# EAGLE design rev001_safe002 (EAGLE 5.08)
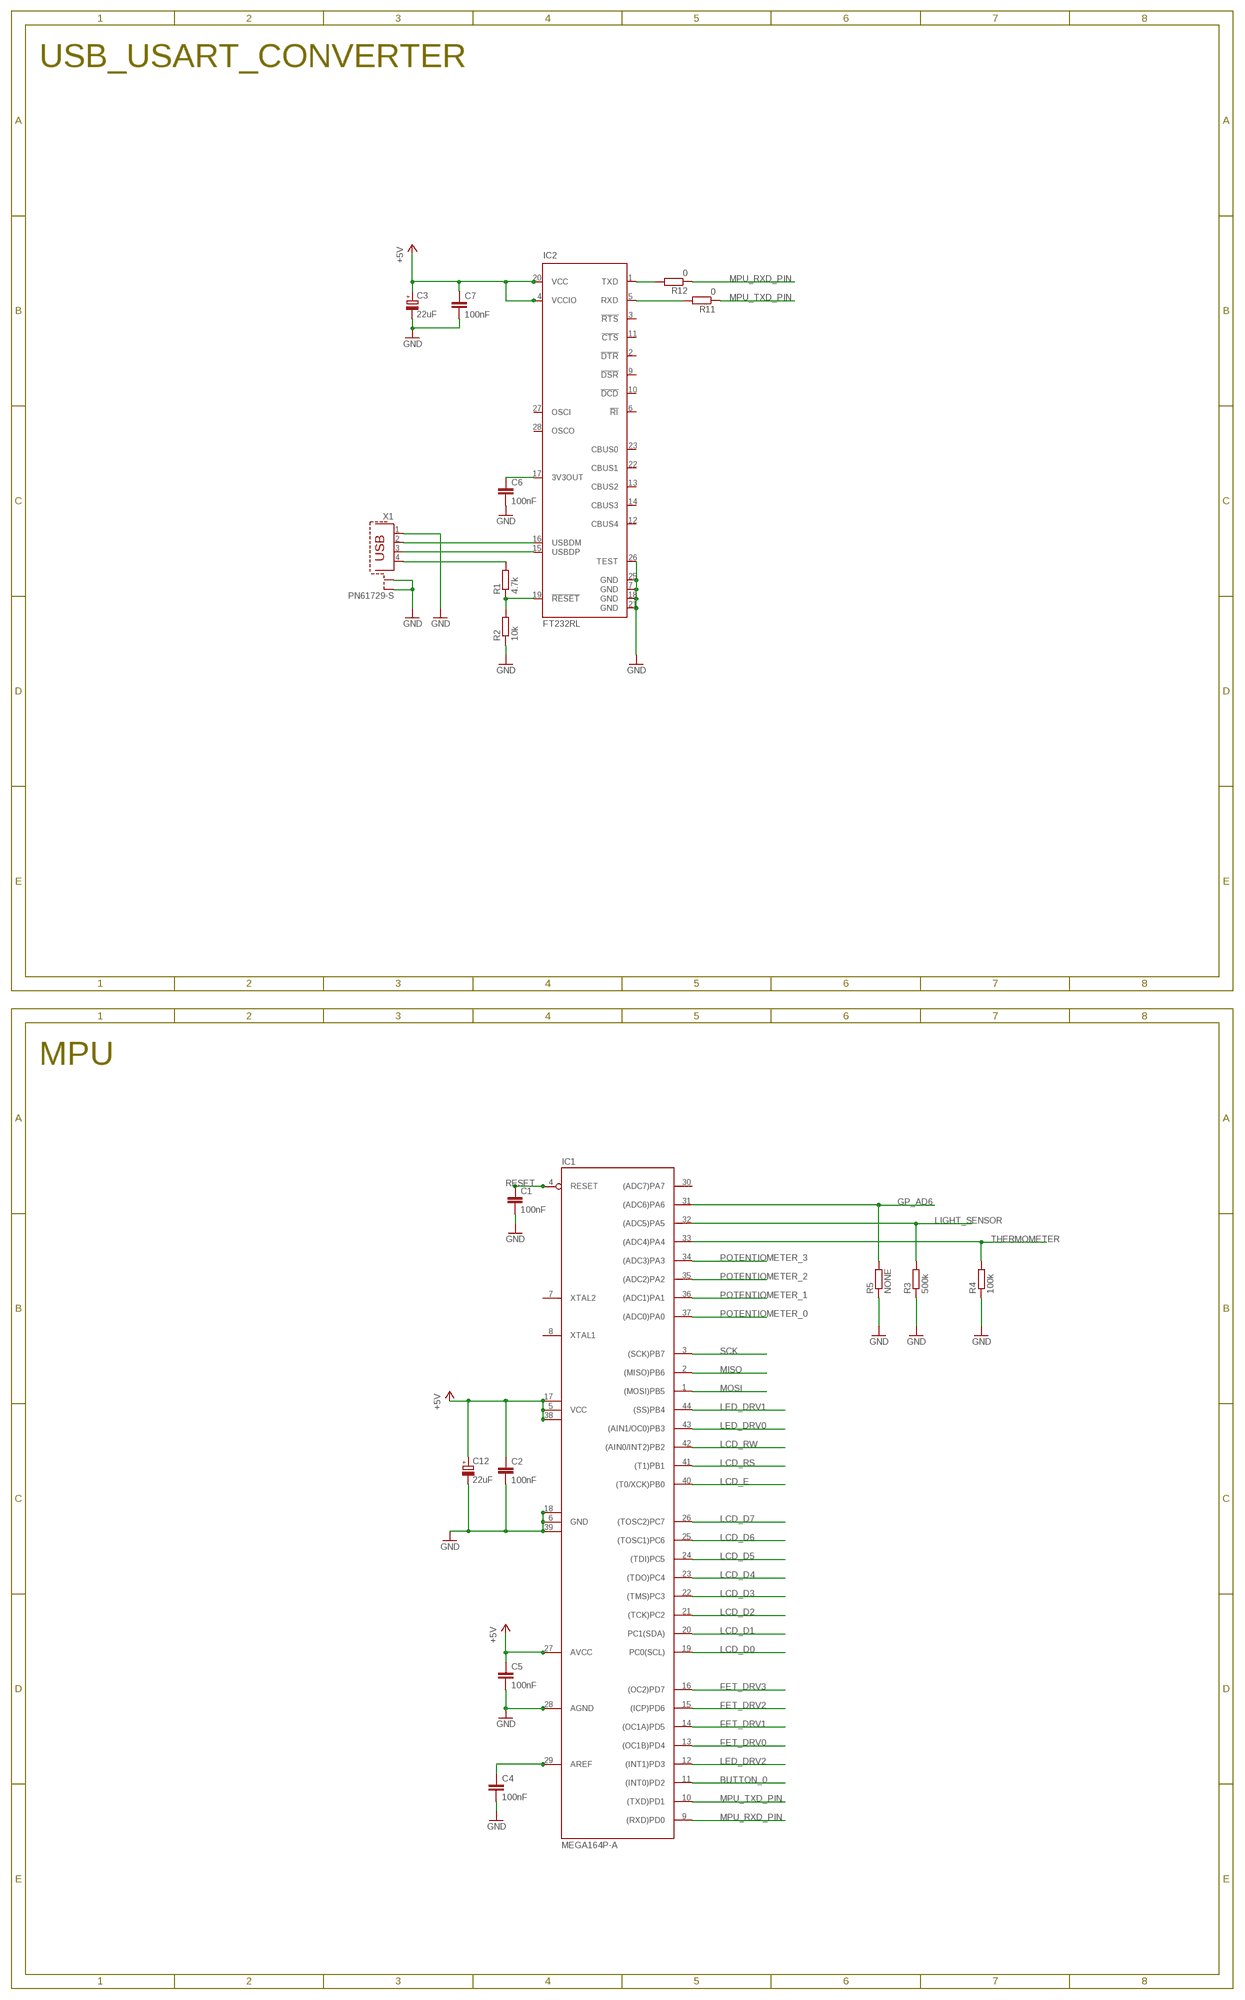
[diagram p0: schematic, sheet 1, part 1 of 2]
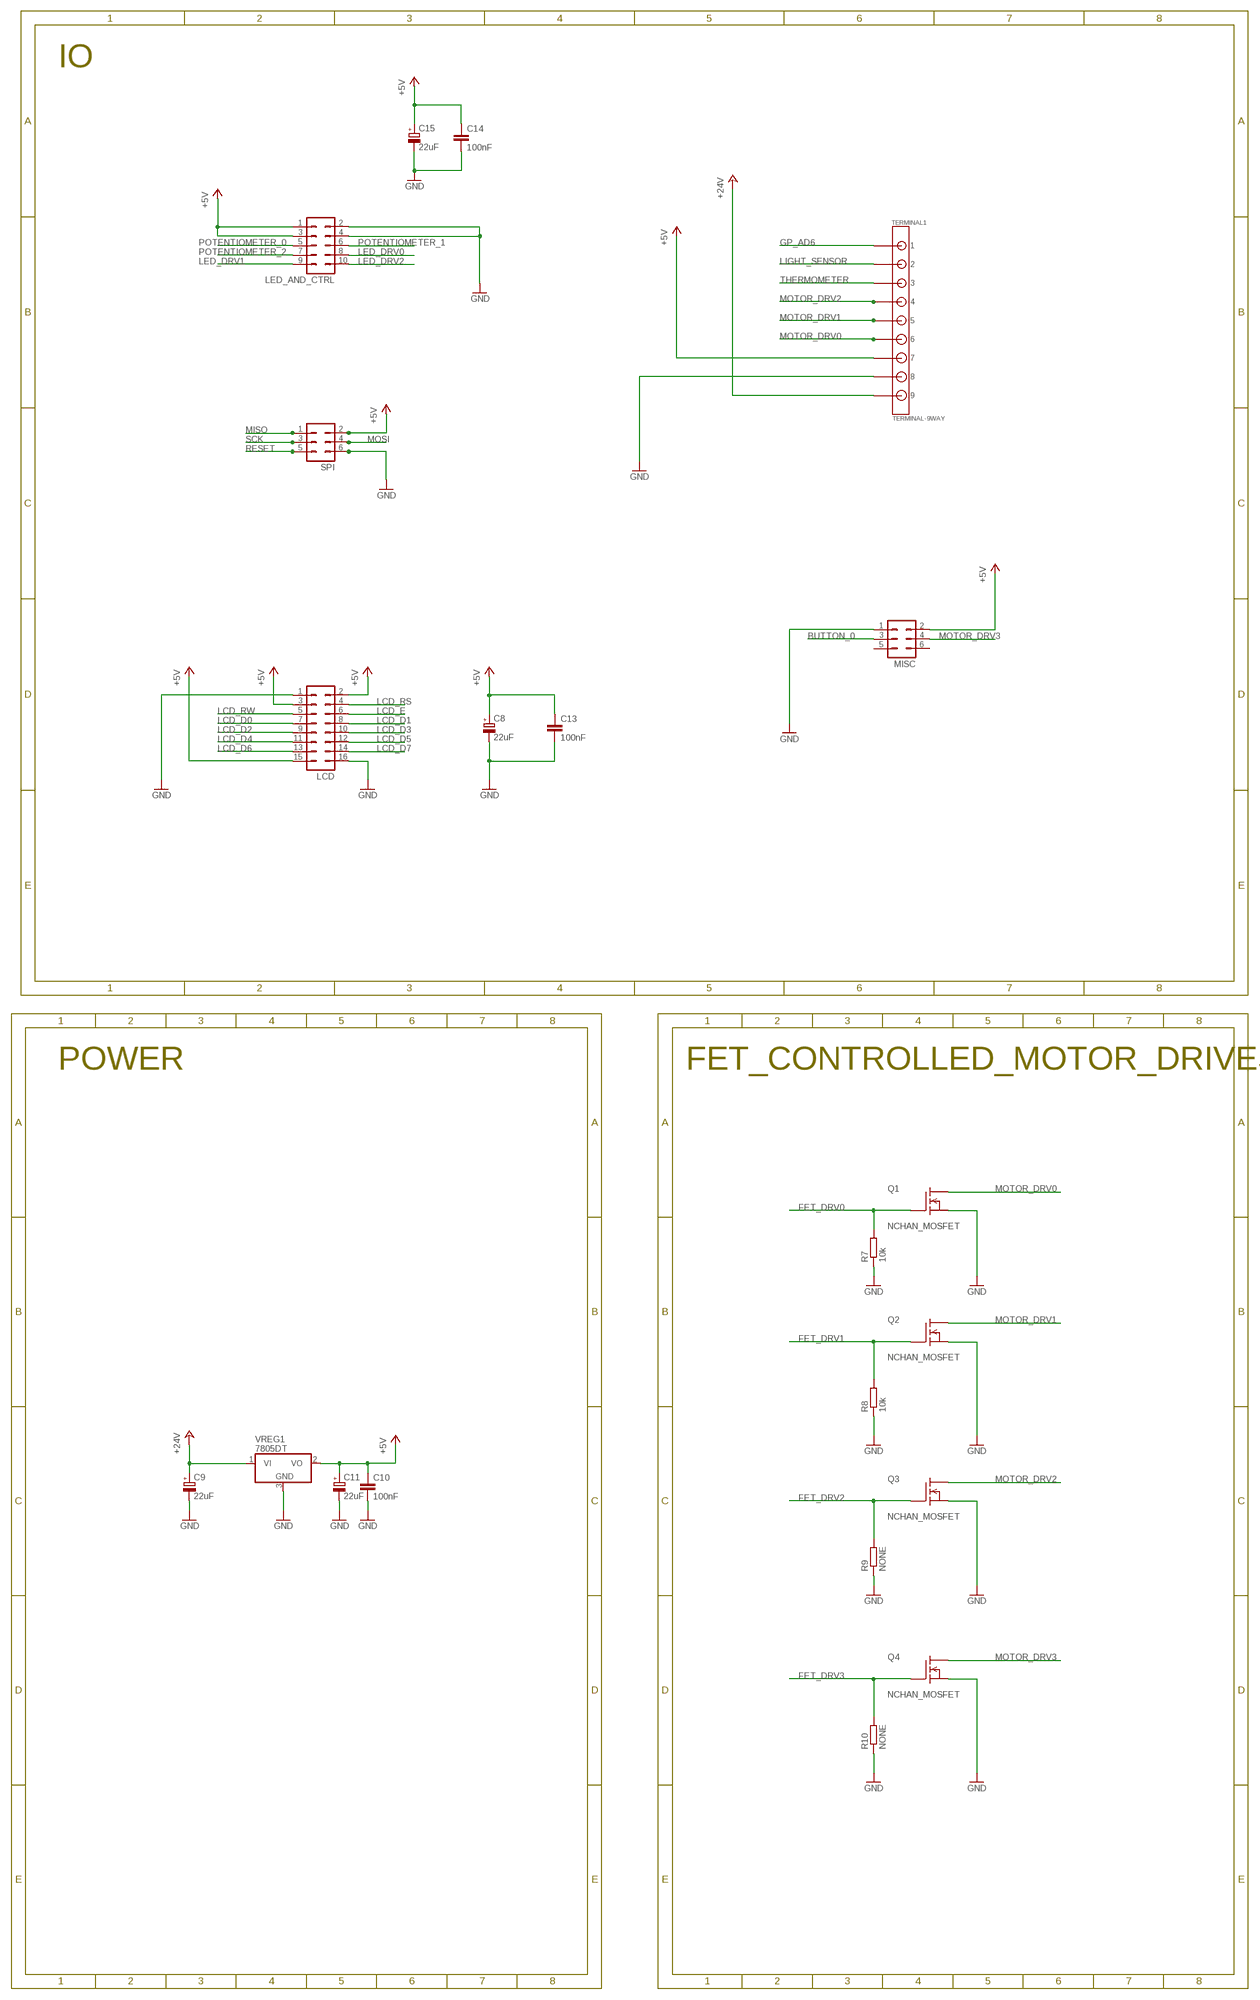
[diagram p1: schematic, sheet 1, part 2 of 2]

## Parts
C1  100nF  C-EUC1206  [C1206]
C2  100nF  C-EUC1206  [C1206]
C3  22uF  CPOL-EUE2.5-6  [E2,5-6]
C4  100nF  C-EUC1206  [C1206]
C5  100nF  C-EUC1206  [C1206]
C6  100nF  C-EUC1206  [C1206]
C7  100nF  C-EUC1206  [C1206]
C8  22uF  CPOL-EUE2.5-6  [E2,5-6]
C9  22uF  CPOL-EUE2.5-6  [E2,5-6]
C10  100nF  C-EUC1206  [C1206]
C11  22uF  CPOL-EUE2.5-6  [E2,5-6]
C12  22uF  CPOL-EUE2.5-6  [E2,5-6]
C13  100nF  C-EUC1206  [C1206]
C14  100nF  C-EUC1206  [C1206]
C15  22uF  CPOL-EUE2.5-6  [E2,5-6]
IC1  MEGA164P-A  [TQFP44]
IC2  FT232RL  [SSOP28]
LCD  MA08-2  [MA08-2]
LED_AND_CTRL  MA05-2  [MA05-2]
MISC  MA03-2  [MA03-2]
Q1  NCHAN_MOSFET  [D2PACK]
Q2  NCHAN_MOSFET  [D2PACK]
Q3  NCHAN_MOSFET  [D2PACK]
Q4  NCHAN_MOSFET  [D2PACK]
R1  4.7k  R-EU_R1206  [R1206]
R2  10k  R-EU_R1206  [R1206]
R3  500k  R-EU_R1206  [R1206]
R4  100k  R-EU_R1206  [R1206]
R5  NONE  R-EU_R1206  [R1206]
R7  10k  R-EU_R1206  [R1206]
R8  10k  R-EU_R1206  [R1206]
R9  NONE  R-EU_R1206  [R1206]
R10  NONE  R-EU_R1206  [R1206]
R11  0  R-EU_R1206  [R1206]
R12  0  R-EU_R1206  [R1206]
SPI  MA03-2  [MA03-2]
TERMINAL1  TERMINAL-9WAY  [TERMINAL-9WAY]
VREG1  7805DT  [TO252]
X1  PN61729-S  [PN61729-S]

## Nets
+5V: C2.1 C3.+ C5.1 C7.1 C8.+ C10.1 C11.+ C12.+ C13.1 C14.1 C15.+ IC1.5(VCC) IC1.17(VCC1) IC1.27(AVCC) IC1.38(VCC2) IC2.4(VCCIO) IC2.20(VCC) LCD.2 LCD.3 LCD.15 LED_AND_CTRL.1 LED_AND_CTRL.3 MISC.2 SPI.2 TERMINAL1.P$7 VREG1.2(VO)
+24V: C9.+ TERMINAL1.P$9 VREG1.1(VI)
BUTTON_0: IC1.11((INT0)PD2) MISC.3
FET_DRV0: IC1.13((OC1B)PD4) Q1.1(G) R7.2
FET_DRV1: IC1.14((OC1A)PD5) Q2.1(G) R8.2
FET_DRV2: IC1.15((ICP)PD6) Q3.1(G) R9.2
FET_DRV3: IC1.16((OC2)PD7) Q4.1(G) R10.2
GND: C1.2 C2.2 C3.- C4.2 C5.2 C6.2 C7.2 C8.- C9.- C10.2 C11.- C12.- C13.2 C14.2 C15.- IC1.6(GND) IC1.18(GND1) IC1.28(AGND) IC1.39(GND2) IC2.7(GND) IC2.18(GND) IC2.21(GND) IC2.25(GND) IC2.26(TEST) LCD.1 LCD.16 LED_AND_CTRL.2 LED_AND_CTRL.4 MISC.1 Q1.3(S) Q2.3(S) Q3.3(S) Q4.3(S) R2.1 R3.1 R4.1 R5.1 R7.1 R8.1 R9.1 R10.1 SPI.6 TERMINAL1.P$8 VREG1.3(GND) X1.1 X1.S1 X1.S2
GP_AD6: IC1.31((ADC6)PA6) R5.2 TERMINAL1.P$1
LCD_D0: IC1.19(PC0(SCL)) LCD.7
LCD_D1: IC1.20(PC1(SDA)) LCD.8
LCD_D2: IC1.21((TCK)PC2) LCD.9
LCD_D3: IC1.22((TMS)PC3) LCD.10
LCD_D4: IC1.23((TDO)PC4) LCD.11
LCD_D5: IC1.24((TDI)PC5) LCD.12
LCD_D6: IC1.25((TOSC1)PC6) LCD.13
LCD_D7: IC1.26((TOSC2)PC7) LCD.14
LCD_E: IC1.40((T0/XCK)PB0) LCD.6
LCD_RS: IC1.41((T1)PB1) LCD.4
LCD_RW: IC1.42((AIN0/INT2)PB2) LCD.5
LED_DRV0: IC1.43((AIN1/OC0)PB3) LED_AND_CTRL.8
LED_DRV1: IC1.44((SS)PB4) LED_AND_CTRL.9
LED_DRV2: IC1.12((INT1)PD3) LED_AND_CTRL.10
LIGHT_SENSOR: IC1.32((ADC5)PA5) R3.2 TERMINAL1.P$2
MISO: IC1.2((MISO)PB6) SPI.1
MOSI: IC1.1((MOSI)PB5) SPI.4
MOTOR_DRV0: Q1.2(D) TERMINAL1.P$6
MOTOR_DRV1: Q2.2(D) TERMINAL1.P$5
MOTOR_DRV2: Q3.2(D) TERMINAL1.P$4
MOTOR_DRV3: MISC.4 Q4.2(D)
MPU_RXD_PIN: IC1.9((RXD)PD0) R12.1
MPU_TXD_PIN: IC1.10((TXD)PD1) R11.1
N$1: C4.1 IC1.29(AREF)
N$4: IC2.1(TXD) R12.2
N$5: IC2.5(RXD) R11.2
N$10: C6.1 IC2.17(3V3OUT)
N$11: IC2.15(USBDP) X1.3
N$12: IC2.16(USBDM) X1.2
N$13: R1.2 X1.4
N$14: IC2.19(!RESET) R1.1 R2.2
POTENTIOMETER_0: IC1.37((ADC0)PA0) LED_AND_CTRL.5
POTENTIOMETER_1: IC1.36((ADC1)PA1) LED_AND_CTRL.6
POTENTIOMETER_2: IC1.35((ADC2)PA2) LED_AND_CTRL.7
POTENTIOMETER_3: IC1.34((ADC3)PA3)
RESET: C1.1 IC1.4(RESET) SPI.5
SCK: IC1.3((SCK)PB7) SPI.3
THERMOMETER: IC1.33((ADC4)PA4) R4.2 TERMINAL1.P$3
Unconnected: IC1.7(XTAL2) IC1.8(XTAL1) IC1.30((ADC7)PA7) IC2.2(!DTR) IC2.3(!RTS) IC2.6(!RI) IC2.9(!DSR) IC2.10(!DCD) IC2.11(!CTS) IC2.12(CBUS4) IC2.13(CBUS2) IC2.14(CBUS3) IC2.22(CBUS1) IC2.23(CBUS0) IC2.27(OSCI) IC2.28(OSCO) MISC.5 MISC.6

## Notes on the sheet
- USB_USART_CONVERTER | IO
- MPU | POWER | FET_CONTROLLED_MOTOR_DRIVES

## Library data of the parts
C1 C2 C4-C7 C10 C13 C14 = hakkeenpoltto-smd:C-EU: CAPACITOR, European symbol
C3 C8 C9 C11 C12 C15 = hakkeenpoltto-smd:CPOL-EU: POLARIZED CAPACITOR, European symbol
IC1 = hakkeenpoltto-smd:MEGA164P: MICROCONTROLLER 32 Kbytes FLASH 2 Kbytes SRAM 1 Kbytes EEPROM USART 8-channel 10 bit ADC Source: avr.lbr
IC2 = hakkeenpoltto-smd:FT232R: Source: http://www.ftdichip.com/Documents/DataSheets/DS_FT232R_v104.pdf
LCD = hakkeenpoltto-smd:MA08-2: PIN HEADER
LED_AND_CTRL = hakkeenpoltto-smd:MA05-2: PIN HEADER
MISC SPI = hakkeenpoltto-smd:MA03-2: PIN HEADER
Q1-Q4 = hakkeenpoltto-smd:NCHAN_MOSFET: N-Channel Enhancement MOSFET 600V 4Vthv
R1-R5 R7-R12 = hakkeenpoltto-smd:R-EU_: RESISTOR, European symbol
TERMINAL1 = hakkeenpoltto-smd:TERMINAL-9WAY: http://fi.farnell.com/tyco-electronics-amp/282836-9/terminal-block-pcb-5mm-9way/dp/3089101?Ntt=3089101
VREG1 = hakkeenpoltto-smd:78*: Positive VOLTAGE REGULATOR http://fi.farnell.com/taiwan-semiconductor/ts78m05cp/v-reg-5-0v-smd-78m05-to-252-3/dp/7207581
X1 = hakkeenpoltto-smd:PN61729-S: BERG USB connector

## Board
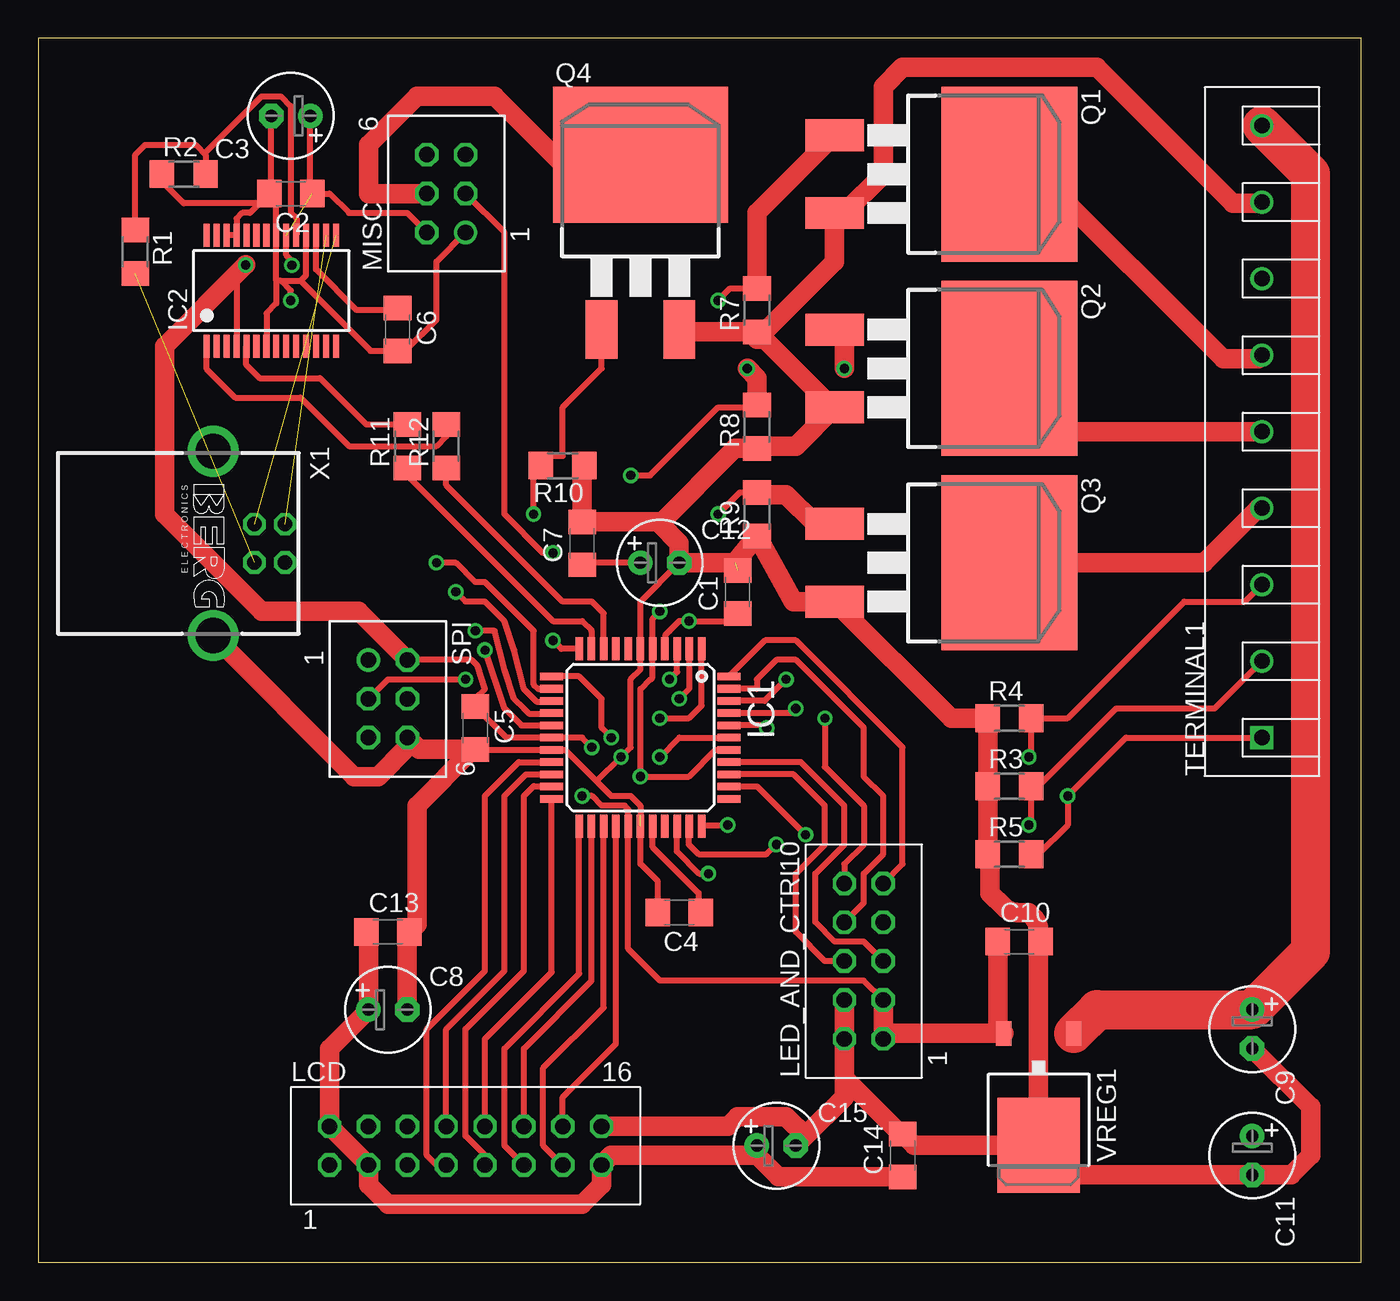
[diagram p2: board, top side]
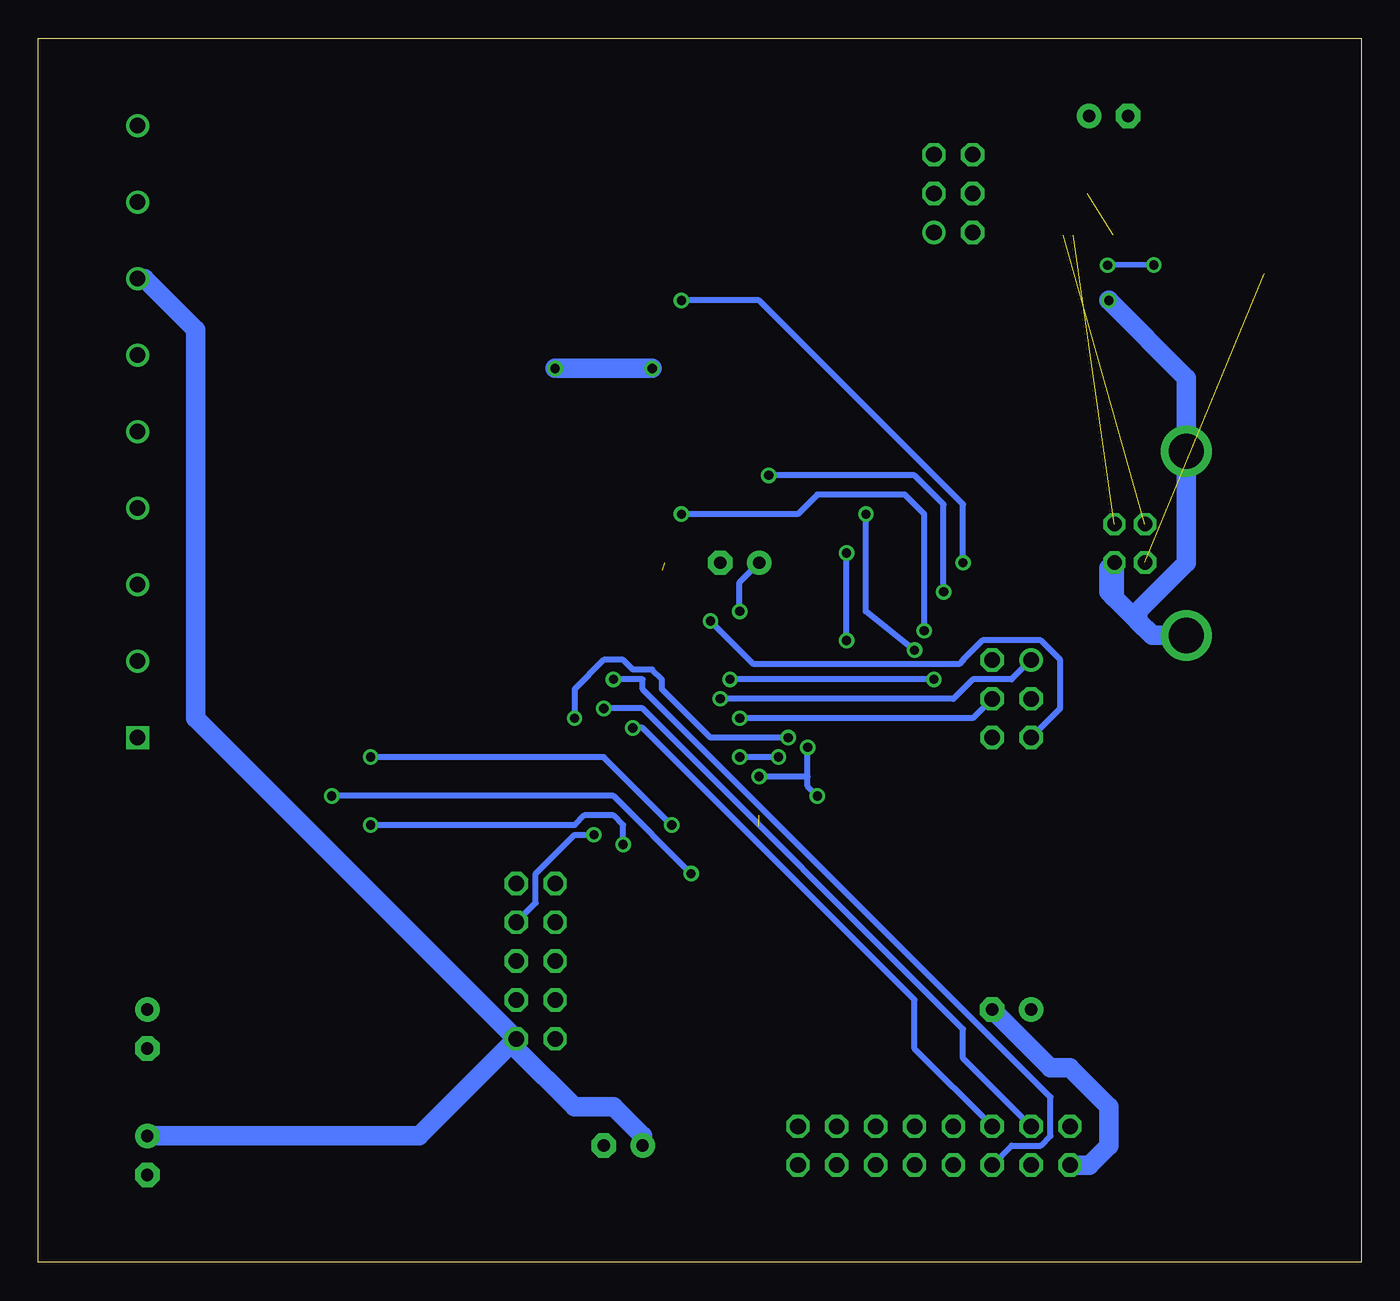
[diagram p3: board, bottom side, seen from below]

Size 86.5 x 80 mm. Coordinates in mm from the lower left corner, seen from the top.
Outline: 0,0 86.5,0 86.5,80 0,80 0,0
Copper layers (1*16): Top 0.035mm / dielectric 1.5mm / Bottom 0.035mm
Design rules "default *": minimum track width 0.2mm, minimum drill 0.4mm, track to track 0.2mm, track to pad 0.2mm, pad to pad 0.2mm, via to via 0.2mm, smd to smd 0.2mm, copper to edge 0.2mm, drill to drill 0.2mm, minimum pad ring 10mil, minimum via ring 8mil, stop-mask expansion 4mil, vias tented up to drill 0mil, thermal gap 10mil
tKeepout: 6 lines

### Footprints (pad centres in the part's own frame; a part is rotated, then mirrored left to right if it is on the bottom)
C1206 = smd 1.6 x 1.8: 1 -1.4,0; 2 1.4,0
E2,5-6 = drill 0.813 pad 1.6 round: + -1.27,0 | drill 0.813 pad 1.6 octagon: - 1.27,0
TQFP44 = smd 1.5 x 0.5: 1 -5.8,4; 2 -5.8,3.2; 3 -5.8,2.4; 4 -5.8,1.6; 5 -5.8,0.8; 6 -5.8,0; 7 -5.8,-0.8; 8 -5.8,-1.6; 9 -5.8,-2.4; 10 -5.8,-3.2; 11 -5.8,-4; 23 5.8,-4; 24 5.8,-3.2; 25 5.8,-2.4; 26 5.8,-1.6; 27 5.8,-0.8; 28 5.8,0; 29 5.8,0.8; 30 5.8,1.6; 31 5.8,2.4; 32 5.8,3.2; 33 5.8,4 | smd 0.5 x 1.5: 12 -4,-5.8; 13 -3.2,-5.8; 14 -2.4,-5.8; 15 -1.6,-5.8; 16 -0.8,-5.8; 17 0,-5.8; 18 0.8,-5.8; 19 1.6,-5.8; 20 2.4,-5.8; 21 3.2,-5.8; 22 4,-5.8; 34 4,5.8; 35 3.2,5.8; 36 2.4,5.8; 37 1.6,5.8; 38 0.8,5.8; 39 0,5.8; 40 -0.8,5.8; 41 -1.6,5.8; 42 -2.4,5.8; 43 -3.2,5.8; 44 -4,5.8
SSOP28 = smd 0.4 x 1.5: 1 -4.225,-3.625; 2 -3.575,-3.625; 3 -2.925,-3.625; 4 -2.275,-3.625; 5 -1.625,-3.625; 6 -0.975,-3.625; 7 -0.325,-3.625; 8 0.325,-3.625; 9 0.975,-3.625; 10 1.625,-3.625; 11 2.275,-3.625; 12 2.925,-3.625; 13 3.575,-3.625; 14 4.225,-3.625; 15 4.225,3.625; 16 3.575,3.625; 17 2.925,3.625; 18 2.275,3.625; 19 1.625,3.625; 20 0.975,3.625; 21 0.325,3.625; 22 -0.325,3.625; 23 -0.975,3.625; 24 -1.625,3.625; 25 -2.275,3.625; 26 -2.925,3.625; 27 -3.575,3.625; 28 -4.225,3.625
MA08-2 = drill 1.016 octagon: 1 -8.89,-1.27; 2 -8.89,1.27; 3 -6.35,-1.27; 4 -6.35,1.27; 5 -3.81,-1.27; 6 -3.81,1.27; 7 -1.27,-1.27; 8 -1.27,1.27; 9 1.27,-1.27; 10 1.27,1.27; 11 3.81,-1.27; 12 3.81,1.27; 13 6.35,-1.27; 14 6.35,1.27; 15 8.89,-1.27; 16 8.89,1.27
MA05-2 = drill 1.016 octagon: 1 -5.08,-1.27; 2 -5.08,1.27; 3 -2.54,-1.27; 4 -2.54,1.27; 5 0,-1.27; 6 0,1.27; 7 2.54,-1.27; 8 2.54,1.27; 9 5.08,-1.27; 10 5.08,1.27
MA03-2 = drill 1.016 round: 1 -2.54,-1.27 | drill 1.016 octagon: 2 -2.54,1.27; 3 0,-1.27; 4 0,1.27; 5 2.54,-1.27; 6 2.54,1.27
D2PACK = smd 2.083 x 3.81: 1 -2.54,-8.89; 3 2.54,-8.89 | smd 11.43 x 8.89: 2 0,2.54
R1206 = smd 1.6 x 1.803: 1 -1.422,0; 2 1.422,0
TERMINAL-9WAY = drill 1 square: P$1 2.54,-3.81 | drill 1 round: P$2 7.54,-3.81; P$3 12.54,-3.81; P$4 17.54,-3.81; P$5 22.54,-3.81; P$6 27.54,-3.81; P$7 32.54,-3.81; P$8 37.54,-3.81; P$9 42.54,-3.81
TO252 = smd 1 x 1.6: 1 -2.28,-4.8; 2 2.28,-4.8 | smd 5.4 x 6.2: 3 0,2.5
PN61729-S = drill 0.95 octagon: 1 1.25,4.71; 2 -1.25,4.71; 3 -1.25,2.71; 4 1.25,2.71 | drill 2.3 pad 2.9 round: S1 -6.02,0; S2 6.02,0

### Placement (x,y rotation side)
C1  45.72,43.81 90 top
C2  16.51,69.85 180 top
C3  16.51,74.93 180 top
C4  41.91,22.86 180 top
C5  28.57,34.92 270 top
C6  23.5,60.96 270 top
C7  35.56,46.99 90 top
C8  22.86,16.51 0 top
C9  79.38,15.24 270 top
C10  64.14,20.95 0 top
C11  79.38,6.99 270 top
C12  40.64,45.72 0 top
C13  22.86,21.59 0 top
C14  56.52,6.99 90 top
C15  48.26,7.62 0 top
IC1  39.37,34.29 270 top
IC2  15.24,63.5 0 top
LCD  27.94,7.62 0 top
LED_AND_CTRL  53.98,19.68 90 top
MISC  26.67,69.85 90 top
Q1  60.96,71.12 270 top
Q2  60.96,58.42 270 top
Q3  60.96,45.72 270 top
Q4  39.37,69.85 0 top
R1  6.35,66.04 270 top
R2  9.53,71.12 0 top
R3  63.5,31.11 0 top
R4  63.5,35.56 0 top
R5  63.5,26.67 0 top
R7  46.99,62.23 90 top
R8  46.99,54.61 90 top
R9  46.99,48.9 90 top
R10  34.29,52.07 180 top
R11  24.13,53.34 90 top
R12  26.67,53.34 90 top
SPI  22.86,36.83 270 top
TERMINAL1  76.2,31.75 90 top
VREG1  65.41,10.16 180 top
X1  11.43,46.99 270 top

### Tracks (layer width: path | path; a pad name or v marks a point on that pad's centre or on a via)
+5V  (via drill 0.6)  (1 unrouted)
  Top 0.406: LED_AND_CTRL.3 53.98,18.41 40.64,18.41 38.57,20.48 IC1.27 38.57,29.6 38.36,29.81 38.36,29.84 38.35,29.84 36.83,29.84 36.2,30.48 v35.56,30.48 | C12.+ 35.69,45.72 C7.1 | v40.64,42.55 40.17,42.08 IC1.5 40.16,40.08 40.16,38.21 40.05,38.1 40.01,38.1 39.37,37.47 v39.37,31.75 42.55,31.75 44.28,33.49 IC1.38 | v36.2,33.66 35.56,34.29 IC1.17 30.61,34.29 C5.1 28.57,36.83 29.21,37.47 28.72,38.99 28.35,39.37 SPI.2 | C3.+ 17.78,69.98 C2.1 19.05,69.85 20.32,68.58 24.13,68.58 MISC.2 | IC2.4 12.96,64.59 v13.56,65.19 | v16.58,65.16 16.46,65.57 16.22,65.82 IC2.20
  Top 1.27: C13.1 21.59,21.46 C8.+ 19.05,13.97 LCD.2 LCD.3 21.59,5.08 22.86,3.81 35.56,3.81 36.83,5.08 LCD.15 37.47,6.99 46.99,6.99 | C10.1 62.73,15.35 VREG1.2 55.6,14.96 LED_AND_CTRL.1 LED_AND_CTRL.3 | C14.1 48.39,5.58 46.99,6.99 | 46.99,6.99 C15.+ | SPI.2 20.95,42.55 14.61,42.55 8.26,48.9 8.26,59.88 v13.56,65.19
  Bottom 0.406: v40.64,42.55 40.64,44.45 C12.+ | 36.2,31.75 36.2,31.11 v35.56,30.48 | 36.2,31.75 v36.2,33.66 | 36.2,31.75 v39.37,31.75 | v13.56,65.19 v16.58,65.16
  Bottom 1.27: C11.+ 61.59,8.26 LED_AND_CTRL.1 | TERMINAL1.P$7 79.53,64.29 76.2,60.96 76.2,35.56 LED_AND_CTRL.1 | LED_AND_CTRL.1 55.24,13.97 51.44,10.16 48.9,10.16 46.99,8.26 C15.+
+24V
  Top 2.54: TERMINAL1.P$9 83.19,71.12 83.19,20.32 C9.+ 69.23,16.51 VREG1.1
BUTTON_0  (via drill 0.6)
  Top 0.406: IC1.11 34.2,40.09 v33.66,40.64 | v33.66,46.35 33.02,46.35 30.48,48.9 30.48,67.31 MISC.3
  Bottom 0.406: v33.66,40.64 v33.66,46.35
FET_DRV0  (via drill 0.6)
  Top 0.406: R7.2 45.24,63.65 v44.45,62.87 | v26.04,45.72 27.3,45.72 28.57,44.45 29.21,44.45 32.38,41.27 32.38,37.78 32.4,37.77 32.4,37.75 32.68,37.47 33.55,37.47 IC1.13
  Top 1.27: R7.2 46.99,68.58 Q1.1
  Bottom 0.406: v44.45,62.87 39.37,62.87 26.04,49.53 v26.04,45.72
FET_DRV1  (via drill 0.6)
  Top 0.2: 46.99,55.88 R8.2
  Top 0.406: 46.99,55.88 44.45,55.88 40.01,51.44 v38.73,51.44 | v27.3,43.81 27.94,43.18 29.21,43.18 30.48,41.91 31.11,40.01 31.75,37.47 32.38,36.83 32.58,36.64 33.52,36.64 IC1.14
  Top 1.27: R8.2 46.99,57.78 v46.35,58.42 | v52.7,58.42 52.7,60.33 Q2.1
  Bottom 0.406: v38.73,51.44 29.21,51.44 27.3,49.53 v27.3,43.81
  Bottom 1.27: v46.35,58.42 v52.7,58.42
FET_DRV2  (via drill 0.6)
  Top 0.406: R9.2 45.87,50.32 v44.45,48.9 | v28.57,41.27 29.84,41.27 30.48,38.73 31.11,36.83 31.75,36.2 31.75,36.19 32.08,35.85 33.53,35.85 IC1.15
  Top 1.27: Q3.1 50.8,48.26 48.9,50.16 47.14,50.16 R9.2
  Bottom 0.406: v44.45,48.9 36.83,48.9 35.56,50.16 29.84,50.16 28.57,48.9 v28.57,41.27
FET_DRV3  (via drill 0.6)
  Top 0.406: IC1.16 31.59,35.09 30.48,36.2 v29.21,40.01 | v32.38,48.9 32.38,51.59 R10.2 33.5,52.7 34.29,52.7 34.29,55.88 36.83,58.42 Q4.1
  Bottom 0.406: v29.21,40.01 32.38,42.55 v32.38,48.9
GND  (via drill 0.6)  (2 unrouted)
  Top 0.406: C4.2 40.51,24.89 39.37,26.04 IC1.28 | C5.2 28.61,33.49 IC1.18 34.45,33.49 36.51,31.43 | C12.- 39.37,43.18 IC1.6 39.37,38.73 38.73,38.1 38.73,33.66 v38.1,33.02 36.51,31.43 | 36.51,31.43 37.47,30.48 38.73,30.48 39.37,29.84 39.37,29.21 | IC1.39 41.91,34.29 v40.64,33.02 | R2.1 8.1,70.64 9.53,69.22 14.47,69.22 | IC2.26 IC2.25 12.96,68.21 13.34,68.58 13.84,68.58 14.47,69.22 | C2.2 15.56,69.39 IC2.21 15.56,64.14 | C2.2 15.24,69.98 C3.- | 15.56,64.14 15.56,62.67 14.92,62.03 IC2.7 | IC2.18 17.52,64.5 17.14,64.14 | 15.88,64.14 15.56,64.14 | 15.88,64.14 17.14,64.14 | 17.14,64.14 21.72,59.56 C6.2 24,59.56 26.04,61.59 26.04,65.41 MISC.1 | C2.2 14.47,69.22 | v16.51,62.87 16.51,63.5 15.88,64.14
  Top 1.27: C8.- 24.13,21.46 C13.2 24.77,22.09 24.77,29.84 28.41,33.49 28.61,33.49 | 47.47,60.33 R7.1 42.06,60.81 Q4.3 | 47.47,60.33 46.99,60.33 52.07,65.41 Q1.3 52.7,68.58 55.24,71.12 55.24,76.83 56.52,78.11 69.22,78.11 78.11,69.22 79.94,69.22 TERMINAL1.P$8 | 47.47,60.33 51.92,55.88 Q2.3 49.53,53.34 46.99,53.34 R8.1 45.57,53.19 40.64,48.26 | 40.64,48.26 41.91,46.99 C12.- 45.57,45.72 R9.1 49.38,43.18 Q3.3 59.69,35.56 R4.1 R3.1 R5.1 62.23,26.52 62.23,24.13 63.13,23.23 arc45 64.03,22.86 64.77,22.86 65.03,22.6 arc-45 65.41,21.7 65.41,20.95 C10.2 65.41,20.82 VREG1.3 | 40.64,48.26 40.51,48.39 C7.2 35.56,51.92 R10.1 | C9.- 83.19,10.16 83.19,6.99 81.92,5.71 C11.- 67.35,5.71 VREG1.3 | VREG1.3 57.24,7.66 C14.2 56.38,8.38 52.7,12.06 | 52.7,12.06 LED_AND_CTRL.2 LED_AND_CTRL.4 | 52.7,12.06 52.7,10.79 50.16,8.26 | 50.16,8.26 C15.- | LCD.16 45.09,8.89 45.72,9.53 48.9,9.53 50.16,8.26 | C5.2 24.89,33.52 SPI.6 24.13,33.66 22.23,31.75 20.65,31.75 X1.S2
  Bottom 0.406: v38.1,33.02 v40.64,33.02
  Bottom 1.27: C8.- 20.32,12.7 19.05,12.7 16.51,10.16 16.51,7.62 17.78,6.35 LCD.1 | X1.S2 13.66,40.97 14.61,41.91 | 16.14,43.45 16.51,43.81 16.51,45.37 X1.1 16.14,43.45 | 14.61,41.91 16.14,43.45 | 14.61,41.91 14.61,42.55 11.43,45.72 11.43,52.7 11.73,52.7 | 11.73,52.7 12.06,52.7 | 11.73,52.7 X1.S1 11.43,57.78 v16.51,62.87
GP_AD6  (via drill 0.6)
  Top 0.406: R5.2 65.41,26.67 67.31,28.57 v67.31,30.48 71.12,34.29 TERMINAL1.P$1 | v43.81,25.4 43.2,25.4 41.75,26.86 41.75,28.47 IC1.31
  Bottom 0.406: v67.31,30.48 48.9,30.48 v43.81,25.4
LCD_D0
  Top 0.406: IC1.19 31.42,32.69 29.21,30.48 29.21,19.05 25.4,15.24 25.4,6.99 26.04,6.35 LCD.7
LCD_D1
  Top 0.406: IC1.20 31.89,31.89 30.48,30.48 30.48,19.05 26.67,15.24 LCD.8
LCD_D2
  Top 0.406: LCD.9 29.21,6.99 27.94,8.26 27.94,15.24 31.75,19.05 31.75,30.48 32.38,31.11 33.55,31.11 IC1.21
LCD_D3
  Top 0.406: IC1.22 33.57,18.96 29.21,14.61 LCD.10
LCD_D4
  Top 0.406: IC1.23 35.37,18.86 30.48,13.97 30.48,7.62 LCD.11
LCD_D5
  Top 0.406: IC1.24 36.17,18.39 31.75,13.97 LCD.12
LCD_D6
  Top 0.406: IC1.25 36.97,16.65 33.02,12.7 33.02,7.62 LCD.13
LCD_D7
  Top 0.406: IC1.26 37.77,14.28 34.29,10.79 LCD.14
LCD_E  (via drill 0.6)
  Top 0.406: IC1.40 47.46,35.09 v47.62,34.92
  Bottom 0.406: v47.62,34.92 46.99,34.92 29.21,17.14 29.21,13.97 LCD.6
LCD_RS  (via drill 0.6)
  Top 0.406: IC1.41 49.23,35.89 v49.53,36.2
  Bottom 0.406: v49.53,36.2 46.99,36.2 26.04,15.24 26.04,13.34 LCD.4
LCD_RW  (via drill 0.6)
  Top 0.406: IC1.42 47.48,36.69 v48.9,38.1
  Bottom 0.406: v48.9,38.1 46.99,38.1 46.99,37.47 20.32,10.79 20.32,8.26 20.95,7.62 22.86,7.62 LCD.5
LED_DRV0
  Top 0.406: IC1.43 46.97,37.49 46.99,37.47 46.99,38.1 48.26,39.37 49.53,39.37 53.98,34.92 53.98,31.75 55.24,30.48 55.24,26.67 53.98,25.4 53.98,23.5 LED_AND_CTRL.8
LED_DRV1
  Top 0.406: IC1.44 47.52,40.64 49.53,40.64 56.52,33.66 56.52,26.04 LED_AND_CTRL.9
LED_DRV2  (via drill 0.6)
  Top 0.406: IC1.12 35.37,38.29 36.83,36.83 36.83,34.92 v37.47,34.29 | v51.44,35.56 51.44,32.38 53.98,29.84 53.98,27.3 52.7,26.04 LED_AND_CTRL.10
  Bottom 0.406: v37.47,34.29 42.55,34.29 45.72,37.47 45.72,38.1 46.35,38.73 47.62,38.73 48.26,39.37 49.53,39.37 51.44,37.47 v51.44,35.56
LIGHT_SENSOR  (via drill 0.6)
  Top 0.406: v64.77,28.57 64.92,28.73 R3.2 65.41,31.11 70.48,36.2 76.92,36.2 TERMINAL1.P$2 | IC1.32 42.55,28.46 42.55,27.3 43.18,26.67 47.62,26.67 v48.26,27.3
  Bottom 0.406: v64.77,28.57 51.44,28.57 50.8,29.21 48.9,29.21 48.26,28.57 v48.26,27.3
MISO  (via drill 0.6)
  Top 0.406: IC1.2 42.57,37.49 v41.91,36.83
  Bottom 0.406: v41.91,36.83 26.67,36.83 25.4,38.1 22.86,38.1 SPI.1
MOSI  (via drill 0.6)
  Top 0.406: IC1.1 43.37,36.38 42.55,35.56 v40.64,35.56
  Bottom 0.406: SPI.4 25.4,35.56 v40.64,35.56
MOTOR_DRV0
  Top 1.27: Q1.2 65.41,71.12 77.47,59.05 79.78,59.05 TERMINAL1.P$6
MOTOR_DRV1
  Top 1.27: TERMINAL1.P$5 67.63,54.29 Q2.2
MOTOR_DRV2
  Top 1.27: TERMINAL1.P$4 79.77,49.29 76.2,45.72 Q3.2
MOTOR_DRV3
  Top 0.2: 39.37,71.12 Q4.2
  Top 1.27: 39.37,71.12 34.92,71.12 29.84,76.2 24.77,76.2 21.59,73.03 21.59,69.85 MISC.4
MPU_RXD_PIN
  Top 0.406: IC1.9 36.97,42.41 36.2,43.18 34.29,43.18 26.67,50.8 R12.1
MPU_TXD_PIN
  Top 0.406: IC1.10 36.17,41.25 36.2,41.27 35.56,41.91 33.66,41.91 24.13,51.44 R11.1
N$1
  Top 0.406: 43.18,22.86 C4.1 43.18,22.99 43.18,24.13 40.17,27.14 IC1.29
N$4
  Top 0.406: R12.2 26.67,53.98 26.04,53.34 20.32,53.34 17.14,56.52 12.89,56.52 11.02,58.38 11.02,59.87 IC2.1
N$5
  Top 0.406: R11.2 21.44,54.76 18.41,57.78 14.47,57.78 13.6,58.66 13.6,59.86 IC2.5
N$10
  Top 0.406: C6.1 23.5,62.23 20.82,62.23 18.17,64.89 IC2.17
N$11  (1 unrouted)
N$12  (1 unrouted)
N$13  (1 unrouted)
N$14
  Top 0.406: 10.95,72.39 10.95,72.54 14.61,76.2 15.88,76.2 16.51,75.56 16.51,68.59 16.88,68.22 16.88,67.14 IC2.19 | 10.95,72.39 R2.2 | R1.1 6.35,72.39 6.99,73.03 10.31,73.03 10.95,72.39
POTENTIOMETER_0
  Top 0.406: LED_AND_CTRL.5 53.98,20.95 52.07,20.95 50.8,22.23 50.8,25.4 52.7,27.3 52.7,29.84 49.86,32.69 IC1.37
POTENTIOMETER_1
  Top 0.406: IC1.36 49.39,31.89 51.44,29.84 51.44,27.3 49.53,25.4 49.53,21.59 51.44,19.68 LED_AND_CTRL.6
POTENTIOMETER_2  (via drill 0.6)
  Top 0.406: IC1.35 47.02,31.09 v50.16,27.94
  Bottom 0.406: v50.16,27.94 51.44,27.94 53.98,25.4 53.98,23.5 LED_AND_CTRL.7
RESET  (via drill 0.6)
  Top 0.406: C1.1 45.22,41.91 v42.55,41.91 41.91,41.91 41.27,41.27 40.99,40.98 IC1.4
  Bottom 0.406: SPI.5 19.68,36.2 19.68,39.37 20.95,40.64 24.77,40.64 26.04,39.37 26.04,39.34 26.28,39.1 39.73,39.1 v42.55,41.91
SCK  (via drill 0.6)
  Top 0.406: IC1.3 41.77,38.59 v41.27,38.1 | v27.94,38.1 22.86,38.1 SPI.3
  Bottom 0.406: v27.94,38.1 v41.27,38.1
THERMOMETER  (via drill 0.6)
  Top 0.406: v64.77,33.02 64.92,33.17 R4.2 67.31,35.56 74.93,43.18 78.9,43.18 TERMINAL1.P$3 | v45.09,28.57 43.45,28.57 IC1.33
  Bottom 0.406: v64.77,33.02 49.53,33.02 v45.09,28.57